# EAGLE schematic main (EAGLE 9.1.2)

## Sheet 1 of 4
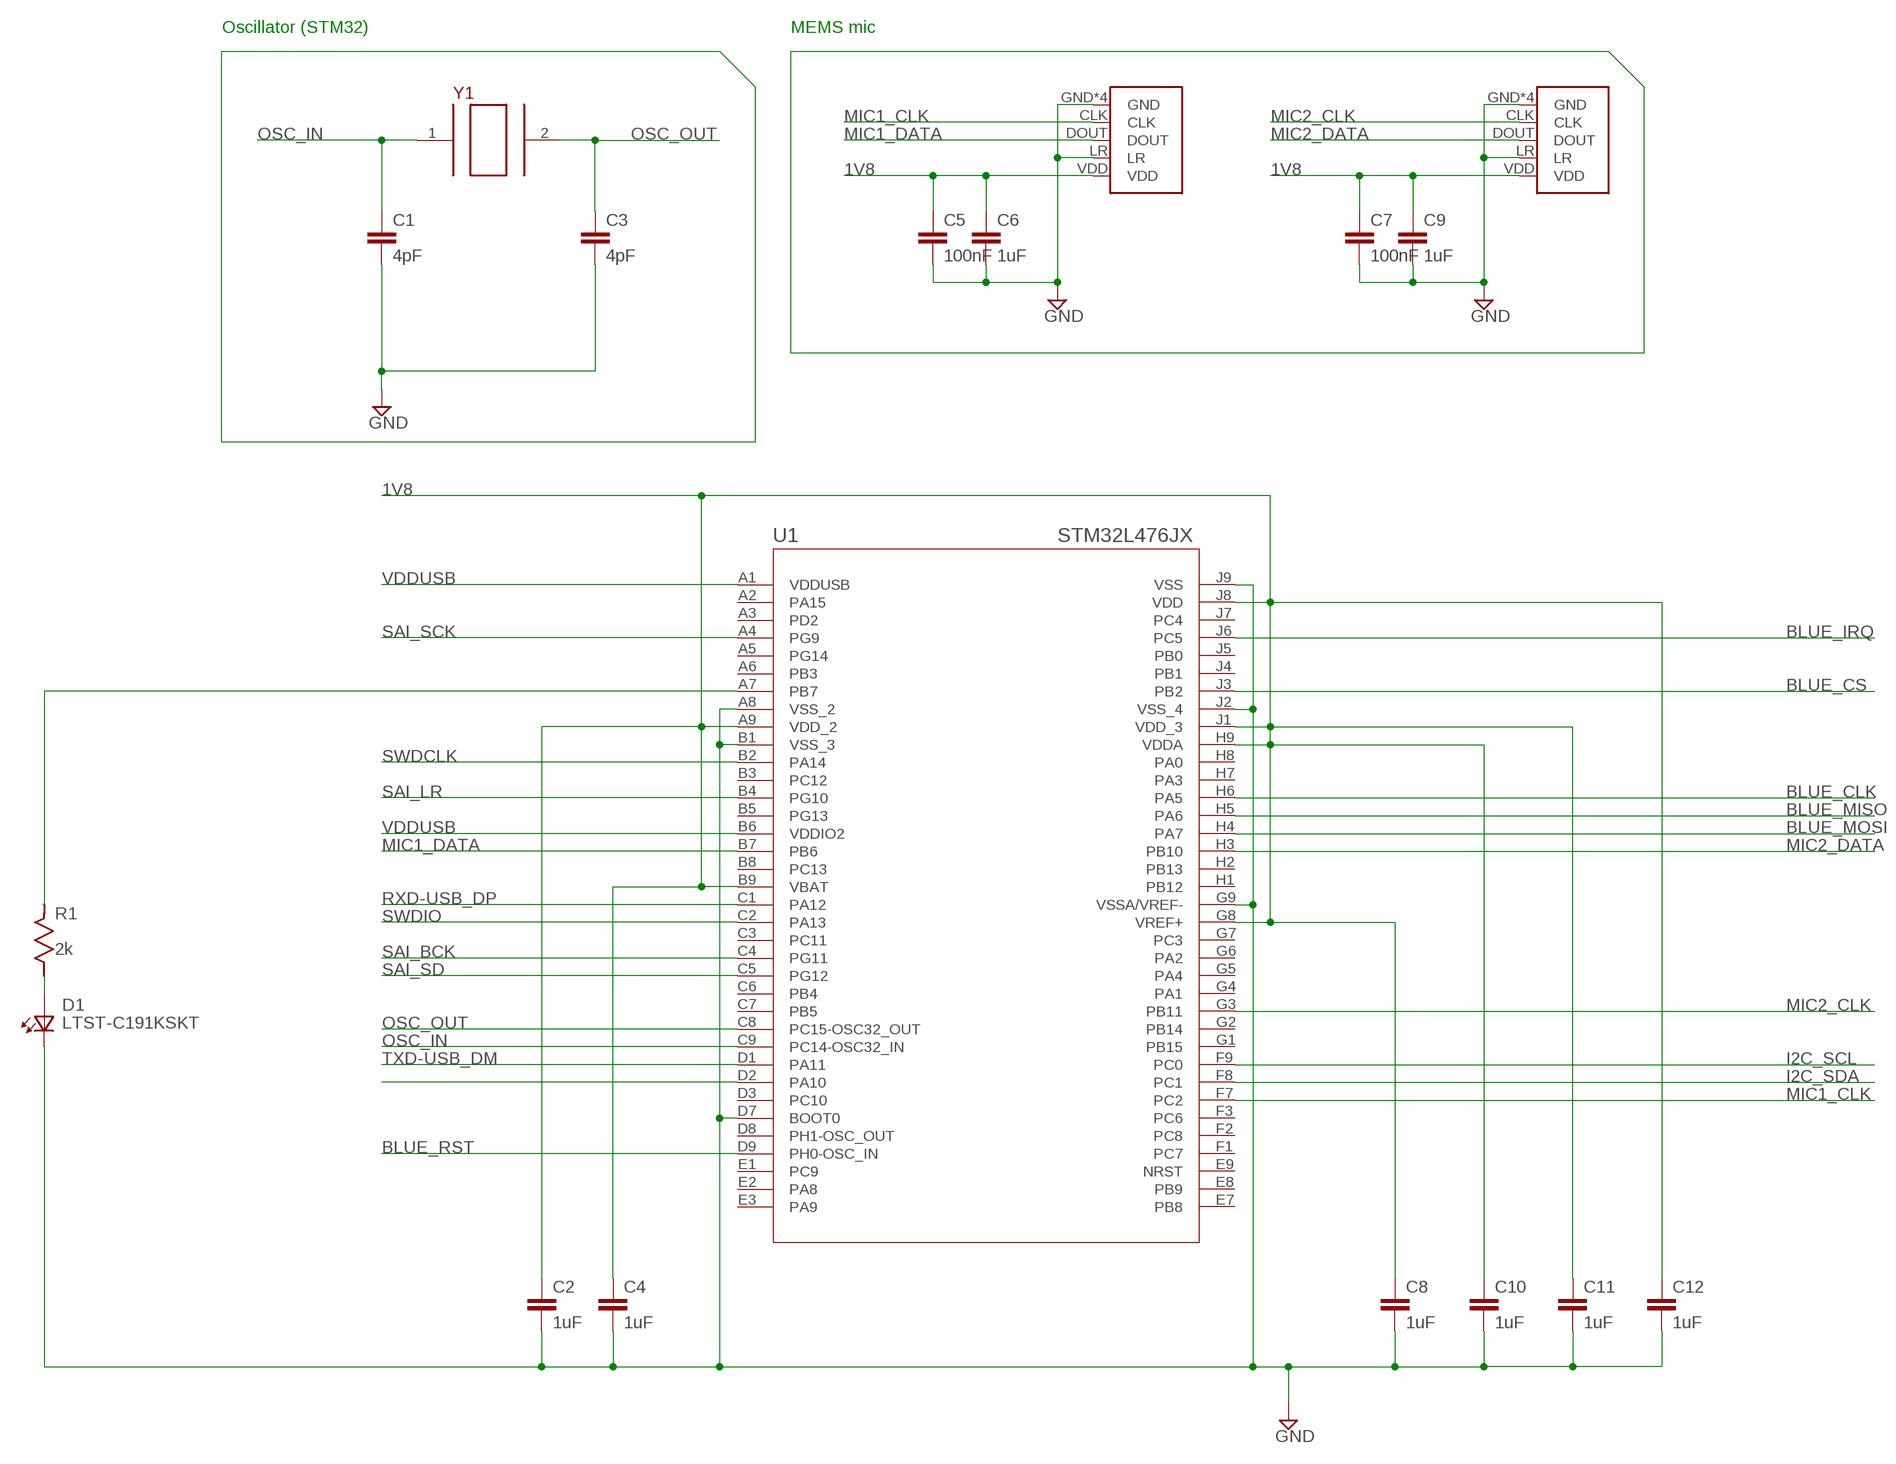
[diagram p0: schematic, sheet 1]

### Parts
C1  4pF  CAP0603  [CAPC0603X30]
C2  1uF  CAP0603  [CAPC0603X30]
C3  4pF  CAP0603  [CAPC0603X30]
C4  1uF  CAP0603  [CAPC0603X30]
C5  100nF  CAP0603  [CAPC0603X30]
C6  1uF  CAP0603  [CAPC0603X30]
C7  100nF  CAP0603  [CAPC0603X30]
C8  1uF  CAP0603  [CAPC0603X30]
C9  1uF  CAP0603  [CAPC0603X30]
C10  1uF  CAP0603  [CAPC0603X30]
C11  1uF  CAP0603  [CAPC0603X30]
C12  1uF  CAP0603  [CAPC0603X30]
D1  LTST-C191KSKT  [0603]
R1  2k  RESISTOR  [CAPC0603X30]
U1  STM32L476JX  [WLCSP72]
U2  MP34DT05-A  [MIC-PACK]
U3  MP34DT05-A  [MIC-PACK]
Y1  ABS06-107SMT  [CAPC2215X70]

### Nets
1V8: C2.1 C4.1 C5.1 C6.1 C7.1 C8.1 C9.1 C10.1 C11.1 C12.1 U1.A9(VDD_2) U1.B9(VBAT) U1.G8(VREF+) U1.H9(VDDA) U1.J1(VDD_3) U1.J8(VDD) U2.VDD U3.VDD ; also sheet 3,4
BLUE_CLK: U1.H6(PA5) ; also sheet 3
BLUE_CS: U1.J3(PB2) ; also sheet 3
BLUE_IRQ: U1.J6(PC5) ; also sheet 3
BLUE_MISO: U1.H5(PA6) ; also sheet 3
BLUE_MOSI: U1.H4(PA7) ; also sheet 3
BLUE_RST: U1.D9(PH0-OSC_IN)
GND: C1.2 C2.2 C3.2 C4.2 C5.2 C6.2 C7.2 C8.2 C9.2 C10.2 C11.2 C12.2 D1.1(K2) U1.A8(VSS_2) U1.B1(VSS_3) U1.D7(BOOT0) U1.G9(VSSA/VREF-) U1.J2(VSS_4) U1.J9(VSS) U2.GND U2.GND1(GND) U2.GND2(GND) U2.GND3(GND) U2.LR U3.GND U3.GND1(GND) U3.GND2(GND) U3.GND3(GND) U3.LR ; also sheet 2,3,4
I2C_SCL: U1.F9(PC0) ; also sheet 2,4
I2C_SDA: U1.F8(PC1) ; also sheet 2,4
MIC1_CLK: U1.F7(PC2) U2.CLK
MIC1_DATA: U1.B7(PB6) U2.DOUT
MIC2_CLK: U1.G3(PB11) U3.CLK
MIC2_DATA: U1.H3(PB10) U3.DOUT
N$1: R1.1 U1.A7(PB7)
N$15: D1.2(A2) R1.2
N$20: U1.D2(PA10)
OSC_IN: C1.1 U1.C9(PC14-OSC32_IN) Y1.1
OSC_OUT: C3.1 U1.C8(PC15-OSC32_OUT) Y1.2
RXD-USB_DP: U1.C1(PA12) ; also sheet 4
SAI_BCK: U1.C4(PG11) ; also sheet 2
SAI_LR: U1.B4(PG10) ; also sheet 2
SAI_SCK: U1.A4(PG9) ; also sheet 2
SAI_SD: U1.C5(PG12) ; also sheet 2
SWDCLK: U1.B2(PA14) ; also sheet 4
SWDIO: U1.C2(PA13) ; also sheet 4
TXD-USB_DM: U1.D1(PA11) ; also sheet 4
VDDUSB: U1.A1(VDDUSB) U1.B6(VDDIO2) ; also sheet 4
Unconnected: U1.A2(PA15) U1.A3(PD2) U1.A5(PG14) U1.A6(PB3) U1.B3(PC12) U1.B5(PG13) U1.B8(PC13) U1.C3(PC11) U1.C6(PB4) U1.C7(PB5) U1.D3(PC10) U1.D8(PH1-OSC_OUT) U1.E1(PC9) U1.E2(PA8) U1.E3(PA9) U1.E7(PB8) U1.E8(PB9) U1.E9(NRST) U1.F1(PC7) U1.F2(PC8) U1.F3(PC6) U1.G1(PB15) U1.G2(PB14) U1.G4(PA1) U1.G5(PA4) U1.G6(PA2) U1.G7(PC3) U1.H1(PB12) U1.H2(PB13) U1.H7(PA3) U1.H8(PA0) U1.J4(PB1) U1.J5(PB0) U1.J7(PC4)

### Notes on the sheet
- Oscillator (STM32) | MEMS mic

## Sheet 2 of 4
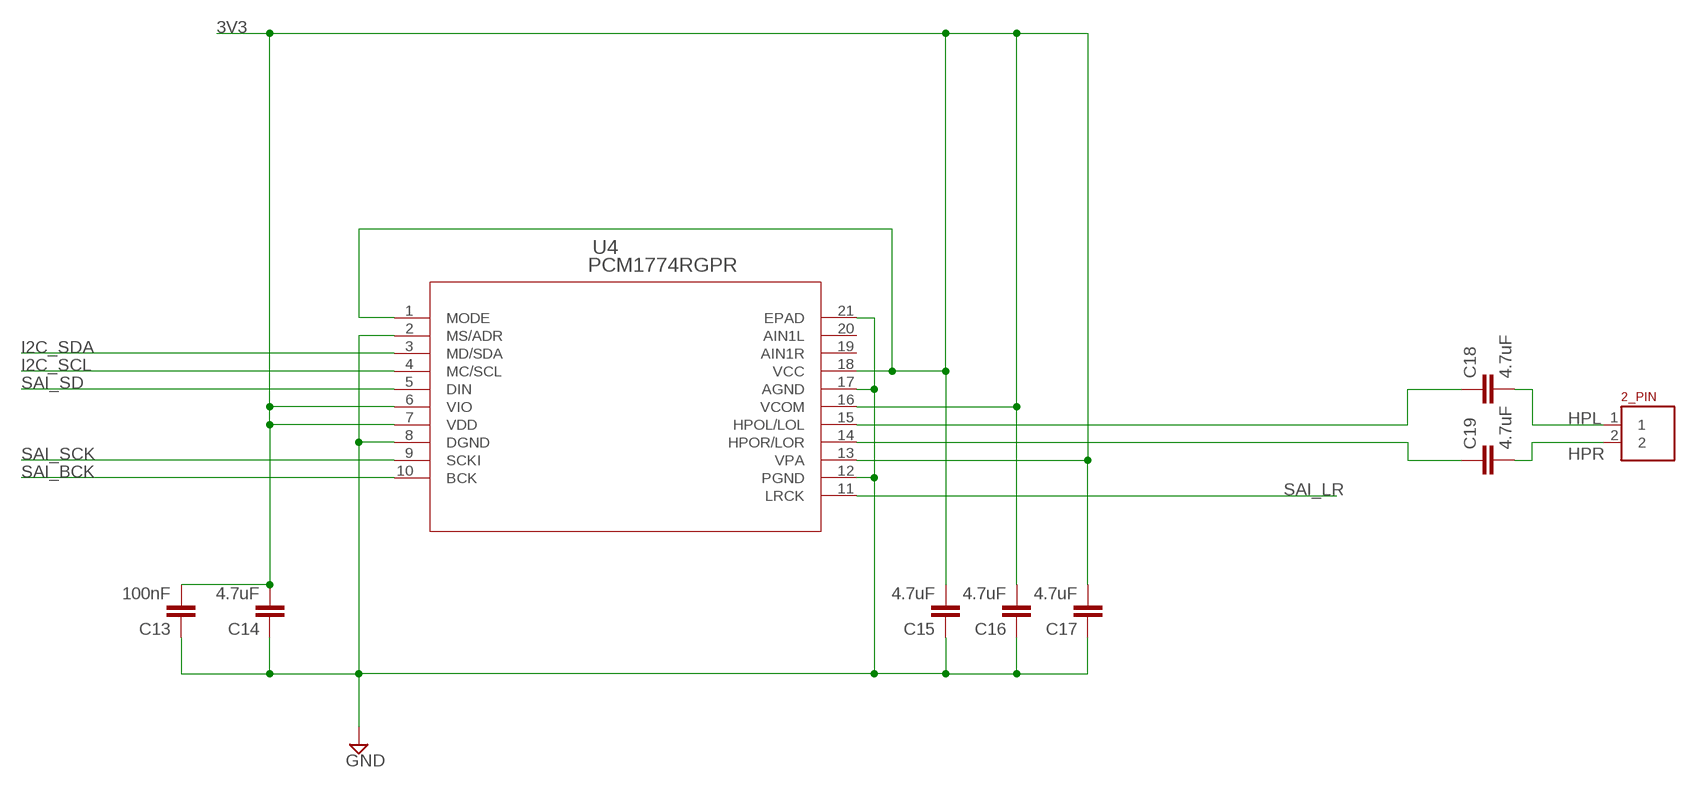
[diagram p1: schematic, sheet 2]

### Parts
C13  100nF  CAP0603  [CAPC0603X30]
C14  4.7uF  CAP0603  [CAPC0603X30]
C15  4.7uF  CAP0603  [CAPC0603X30]
C16  4.7uF  CAP0603  [CAPC0603X30]
C17  4.7uF  CAP0603  [CAPC0603X30]
C18  4.7uF  CAP0603  [CAPC0603X30]
C19  4.7uF  CAP0603  [CAPC0603X30]
J1  2PIN  [2PINCON]
U4  PCM1774RGPR  [RGP20_2P7X2P7]

### Nets
3V3: C13.2 C14.2 C15.2 C16.2 C17.2 U4.1(MODE) U4.6(VIO) U4.7(VDD) U4.13(VPA) U4.16(VCOM) U4.18(VCC) ; also sheet 4
GND: C13.1 C14.1 C15.1 C16.1 C17.1 U4.2(MS/ADR) U4.8(DGND) U4.12(PGND) U4.17(AGND) U4.21(EPAD) ; also sheet 1,3,4
HPL: C18.2 J1.1
HPR: C19.2 J1.2
I2C_SCL: U4.4(MC/SCL) ; also sheet 1,4
I2C_SDA: U4.3(MD/SDA) ; also sheet 1,4
N$3: C18.1 U4.15(HPOL/LOL)
N$10: C19.1 U4.14(HPOR/LOR)
SAI_BCK: U4.10(BCK) ; also sheet 1
SAI_LR: U4.11(LRCK) ; also sheet 1
SAI_SCK: U4.9(SCKI) ; also sheet 1
SAI_SD: U4.5(DIN) ; also sheet 1
Unconnected: U4.19(AIN1R) U4.20(AIN1L)

## Sheet 3 of 4
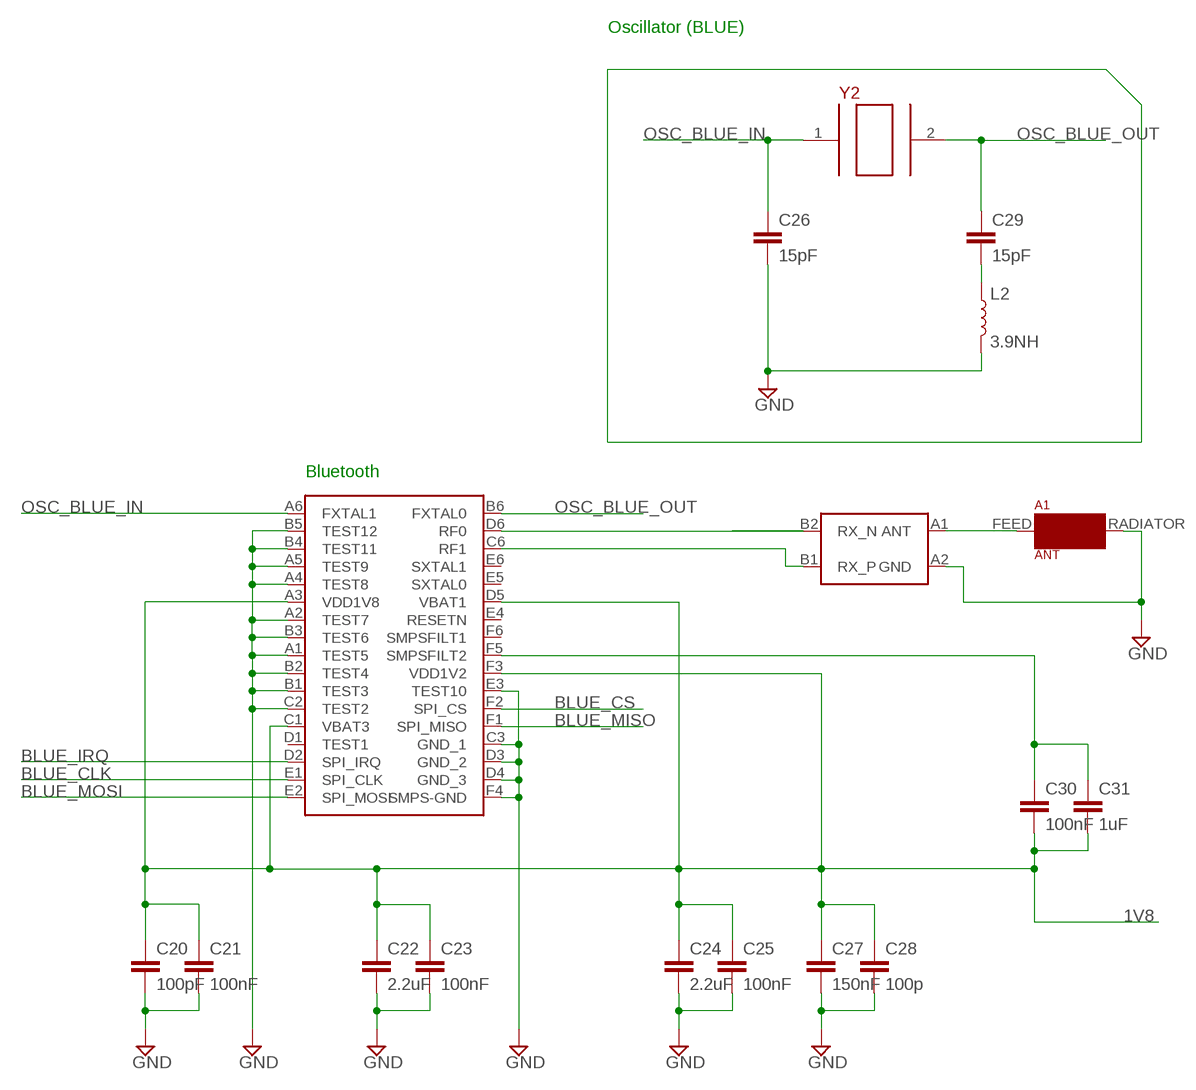
[diagram p2: schematic, sheet 3]

### Parts
A1  ANT  [ANTPACK]
C20  100pF  CAP0603  [CAPC0603X30]
C21  100nF  CAP0603  [CAPC0603X30]
C22  2.2uF  CAP0603  [CAPC0603X30]
C23  100nF  CAP0603  [CAPC0603X30]
C24  2.2uF  CAP0603  [CAPC0603X30]
C25  100nF  CAP0603  [CAPC0603X30]
C26  15pF  CAP0603  [CAPC0603X30]
C27  150nF  CAP0603  [CAPC0603X30]
C28  100p  CAP0603  [CAPC0603X30]
C29  15pF  CAP0603  [CAPC0603X30]
C30  100nF  CAP0603  [CAPC0603X30]
C31  1uF  CAP0603  [CAPC0603X30]
L1  BALF-NRG-01D3  [FLIPCHIP]
L2  3.9NH  INDUCTOR-0402-3.9NH  [0402]
U5  BLUENRG-MS  [WLCSP34]
Y2  ABS06-107SMT  [CAPC2215X70]

### Nets
1V8: C20.1 C21.1 C22.1 C23.1 C24.1 C25.1 C27.1 C28.1 C30.2 C31.2 U5.A3(VDD1V8) U5.C1(VBAT3) U5.D5(VBAT1) U5.F3(VDD1V2) ; also sheet 1,4
BLUE_CLK: U5.E1(SPI_CLK) ; also sheet 1
BLUE_CS: U5.F2(SPI_CS) ; also sheet 1
BLUE_IRQ: U5.D2(SPI_IRQ) ; also sheet 1
BLUE_MISO: U5.F1(SPI_MISO) ; also sheet 1
BLUE_MOSI: U5.E2(SPI_MOSI) ; also sheet 1
GND: A1.RADIATOR C20.2 C21.2 C22.2 C23.2 C24.2 C25.2 C26.2 C27.2 C28.2 L1.A2(GND) L2.2 U5.A1(TEST5) U5.A2(TEST7) U5.A4(TEST8) U5.A5(TEST9) U5.B1(TEST3) U5.B2(TEST4) U5.B3(TEST6) U5.B4(TEST11) U5.B5(TEST12) U5.C2(TEST2) U5.C3(GND_1) U5.D3(GND_2) U5.D4(GND_3) U5.E3(TEST10) U5.F4(SMPS-GND) ; also sheet 1,2,4
N$2: C29.2 L2.1
N$12: A1.FEED L1.A1(ANT)
N$13: L1.B1(RX_P) U5.C6(RF1)
N$14: L1.B2(RX_N) U5.D6(RF0)
N$19: C30.1 C31.1 U5.F5(SMPSFILT2)
OSC_BLUE_IN: C26.1 U5.A6(FXTAL1) Y2.1
OSC_BLUE_OUT: C29.1 U5.B6(FXTAL0) Y2.2

### Notes on the sheet
- Oscillator (BLUE)
- Bluetooth

## Sheet 4 of 4
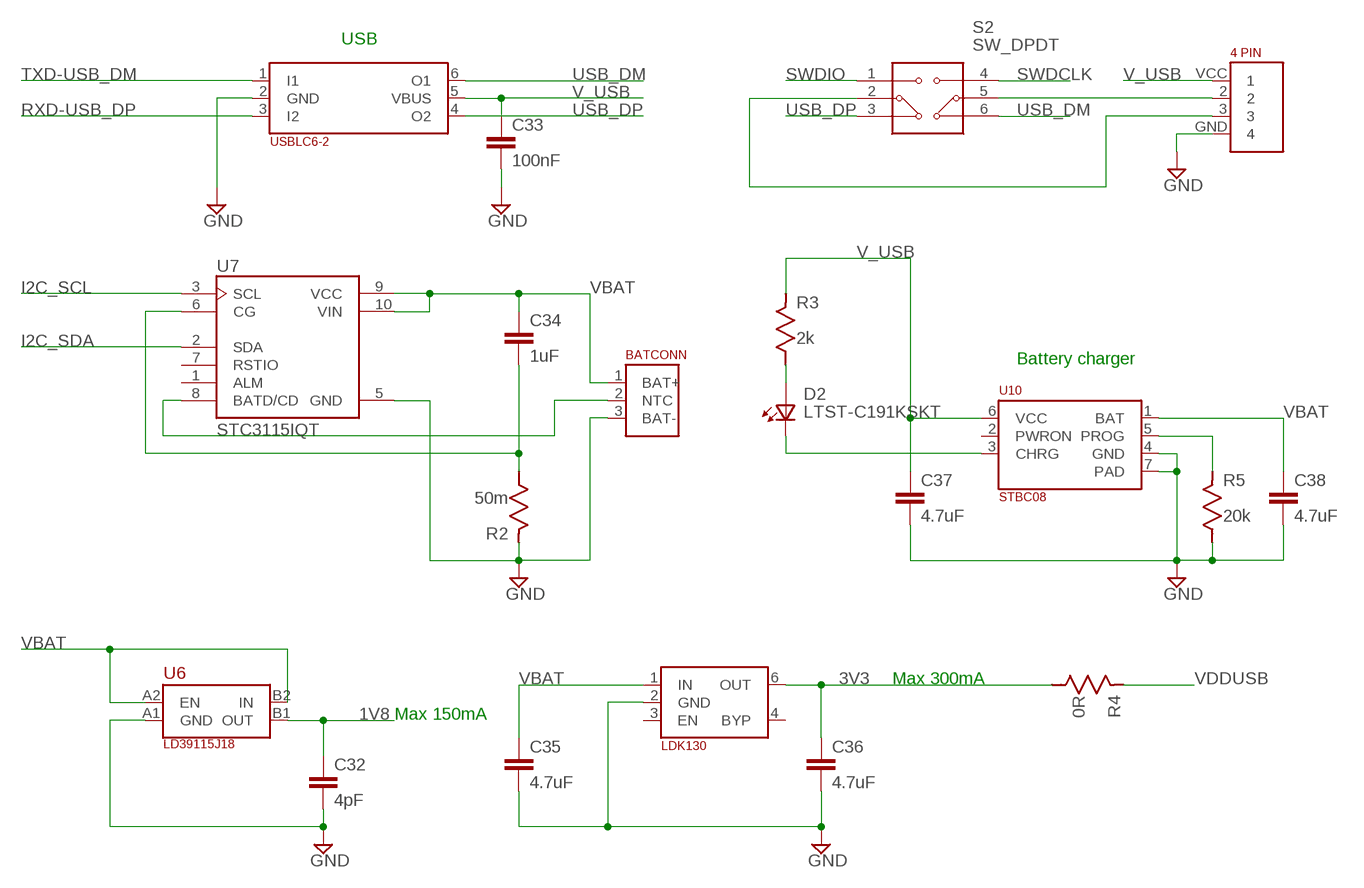
[diagram p3: schematic, sheet 4]

### Parts
C32  4pF  CAP0603  [CAPC0603X30]
C33  100nF  CAP0603  [CAPC0603X30]
C34  1uF  CAP0603  [CAPC0603X30]
C35  4.7uF  CAP0603  [CAPC0603X30]
C36  4.7uF  CAP0603  [CAPC0603X30]
C37  4.7uF  CAP0603  [CAPC0603X30]
C38  4.7uF  CAP0603  [CAPC0603X30]
D2  LTST-C191KSKT  [0603]
J2  BATT  [BATCONN]
J3  CS44  [CS44]
R2  50m  RESISTOR  [CAPC0603X30]
R3  2k  RESISTOR  [CAPC0603X30]
R4  0R  RESISTOR  [CAPC0603X30]
R5  20k  RESISTOR  [CAPC0603X30]
S2  SW_DPDT  [SW_DPDT]
U6  LD39115J18  [FLIPCHIP-2]
U7  STC3115IQT  [SON50P300X200X60-10N]
U8  USBLC6-2  [SOT-666]
U9  LDK130  [DFN6]
U10  STBC08  [DFN6]

### Nets
1V8: C32.1 U6.B1(OUT) ; also sheet 1,3
3V3: C36.1 R4.2 U9.6(OUT) ; also sheet 2
BAT_NTC: J2.2(NTC) U7.8(BATD/CD)
CHRG: D2.1(K2) U10.3(CHRG)
GND: C32.2 C33.2 C35.2 C36.2 C37.2 C38.2 J2.3(BAT-) J3.GND R2.1 R5.2 U6.A1(GND) U7.5(GND) U8.2(GND) U9.2(GND) U10.4(GND) U10.7(PAD) ; also sheet 1,2,3
I2C_SCL: U7.3(SCL) ; also sheet 1,2
I2C_SDA: U7.2(SDA) ; also sheet 1,2
N$6: D2.2(A2) R3.2
N$7: C34.2 R2.2 U7.6(CG)
N$8: R5.1 U10.5(PROG)
N$9: J3.2 S2.5
N$11: J3.3 S2.2
RXD-USB_DP: U8.3(I2) ; also sheet 1
SWDCLK: S2.4 ; also sheet 1
SWDIO: S2.1 ; also sheet 1
TXD-USB_DM: U8.1(I1) ; also sheet 1
USB_DM: S2.6 U8.6(O1)
USB_DP: S2.3 U8.4(O2)
V_USB: C33.1 C37.1 J3.VCC R3.1 U8.5(VBUS) U10.6(VCC)
VBAT: C34.1 C35.1 C38.1 J2.1(BAT+) U6.A2(EN) U6.B2(IN) U7.9(VCC) U7.10(VIN) U9.1(IN) U10.1(BAT)
VDDUSB: R4.1 ; also sheet 1
Unconnected: U7.1(ALM) U7.7(RSTIO) U9.3(EN) U9.4(BYP) U10.2(PWRON)

### Notes on the sheet
- USB
- Battery charger
- Max 300mA
- Max 150mA

## Power pins joined to a net without a drawn wire
RESETN: U5.E4(RESETN)
SMPSFILT1: U5.F6(SMPSFILT1)
SXTAL0: U5.E5(SXTAL0)
SXTAL1: U5.E6(SXTAL1)
TEST1: U5.D1(TEST1)

## Library data of the parts
A1 = OAlib:ANT
C1-C38 = OAlib:CAP
D1 D2 = LTST-C191KSKT:LTST-C191KSKT: http://octopart.com/ltst-c190krkt-lite-on-549893; AVAILABILITY: Good; DESCRIPTION: Yellow 1.6 x 0.8 x 1.1 mm 130° Water Clear 180 mcd 2 V LED Chip SMT; MF: Lite-On; MP: LTST-C191KSKT; PACKAGE: 0603 Lite-On; PRICE: 0.07 USD
J1 = OAlib:2PIN
J2 = OAlib:BATT
J3 = OAlib:CS44
L1 = OAlib:BALF-NRG-01D3
L2 = SparkFun-Coils:INDUCTOR: Inductors Resist changes in electrical current. Basically a coil of wire. SparkFun Products: SparkFun Load Cell Amplifier - HX711 <https://www.sparkfun.com/products/13879> IOIO-OTG - V2.2 <https://www.sparkfun.com/products/13613>; PROD_ID: NDUC-13457
R1-R5 = OAlib:RESISTOR
S2 = OAlib:SW_DPDT: Dip Switch SPDTSurface Mount Slide Switch Source: Datasheet <http://www.nidec-copal-electronics.com/e/catalog/switch/cas.pdf>
U1 = OAlib:STM32L476JX; MANUFACTURER_PART_NUMBER: stm32l476jx; VENDOR: ST Microelectronics
U2 U3 = OAlib:MP34DT05-A
U4 = PCM1774:PCM1774RGPR; MANUFACTURER_PART_NUMBER: PCM1774RGPR; VENDOR: Texas Instruments
U5 = OAlib:BLUENRG-MS
U6 = OAlib:LD39115J18
U7 = STC3115IQT:STC3115IQT: STC3115 Series Gas gauge IC with alarm output for handheld applications; AVAILABILITY: Good; DESCRIPTION: STC3115 Series Gas gauge IC with alarm output for handheld applications; MF: STMicroelectronics; MP: STC3115IQT; PACKAGE: DFN-10 STMicroelectronics; PRICE: 1.80 USD
U8 = OAlib:USBLC6-2
U9 = OAlib:LDK130
U10 = OAlib:STBC08
Y1 Y2 = OAlib:ABS06-107